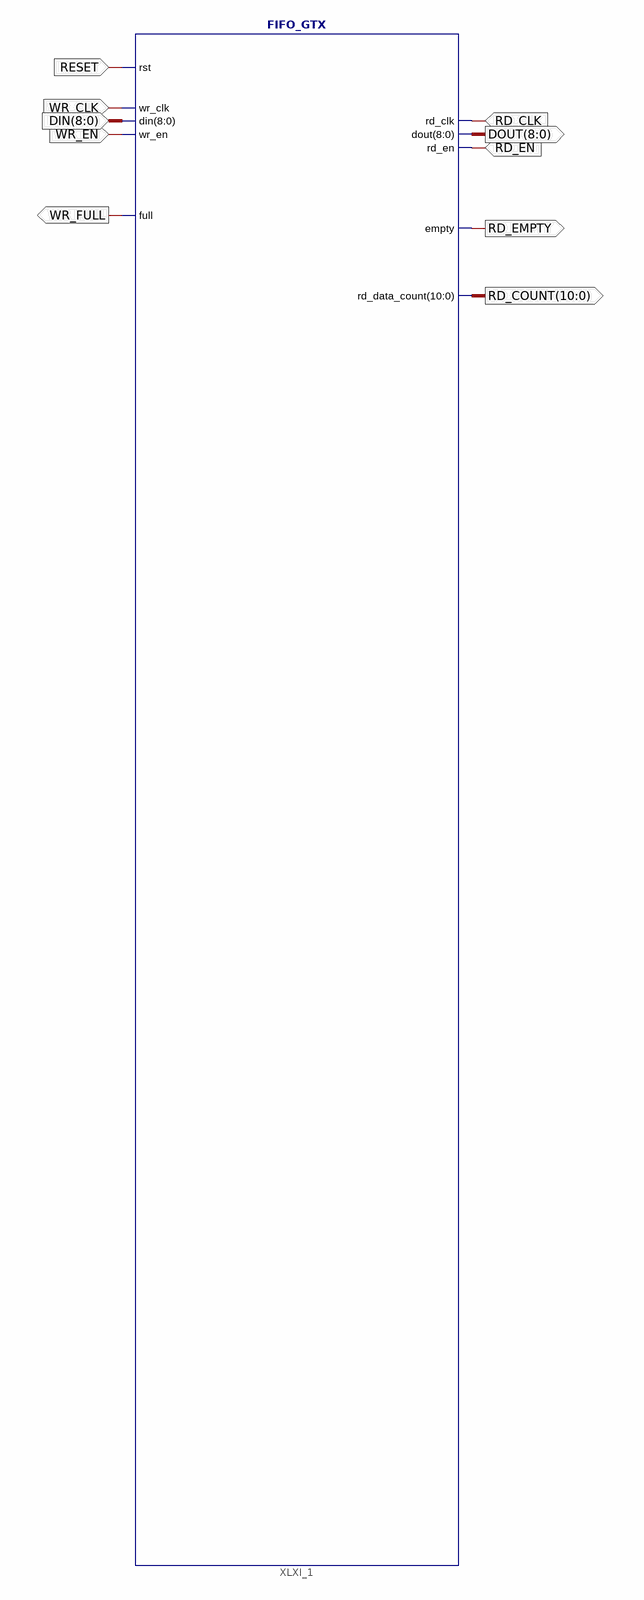
[diagram p0: schematic sheet 1]
// Xilinx ISE schematic FIFO_GTX_SCH.sch (spartan6) as structural Verilog: 1 symbols, 10 ports
module FIFO_GTX_SCH (
  input  WR_CLK,
  input  WR_EN,
  input  RD_CLK,
  input  RD_EN,
  input  [8:0] DIN,
  input  RESET,
  output WR_FULL,
  output RD_EMPTY,
  output [8:0] DOUT,
  output [10:0] RD_COUNT
);

  FIFO_GTX XLXI_1 (
    .rst(RESET), .wr_clk(WR_CLK), .din(DIN), .wr_en(WR_EN), .full(WR_FULL), .rd_clk(RD_CLK), .dout(DOUT),
    .rd_en(RD_EN), .empty(RD_EMPTY), .rd_data_count(RD_COUNT));
endmodule
